# Altium schematic sheet STM32.SchDoc
size A4
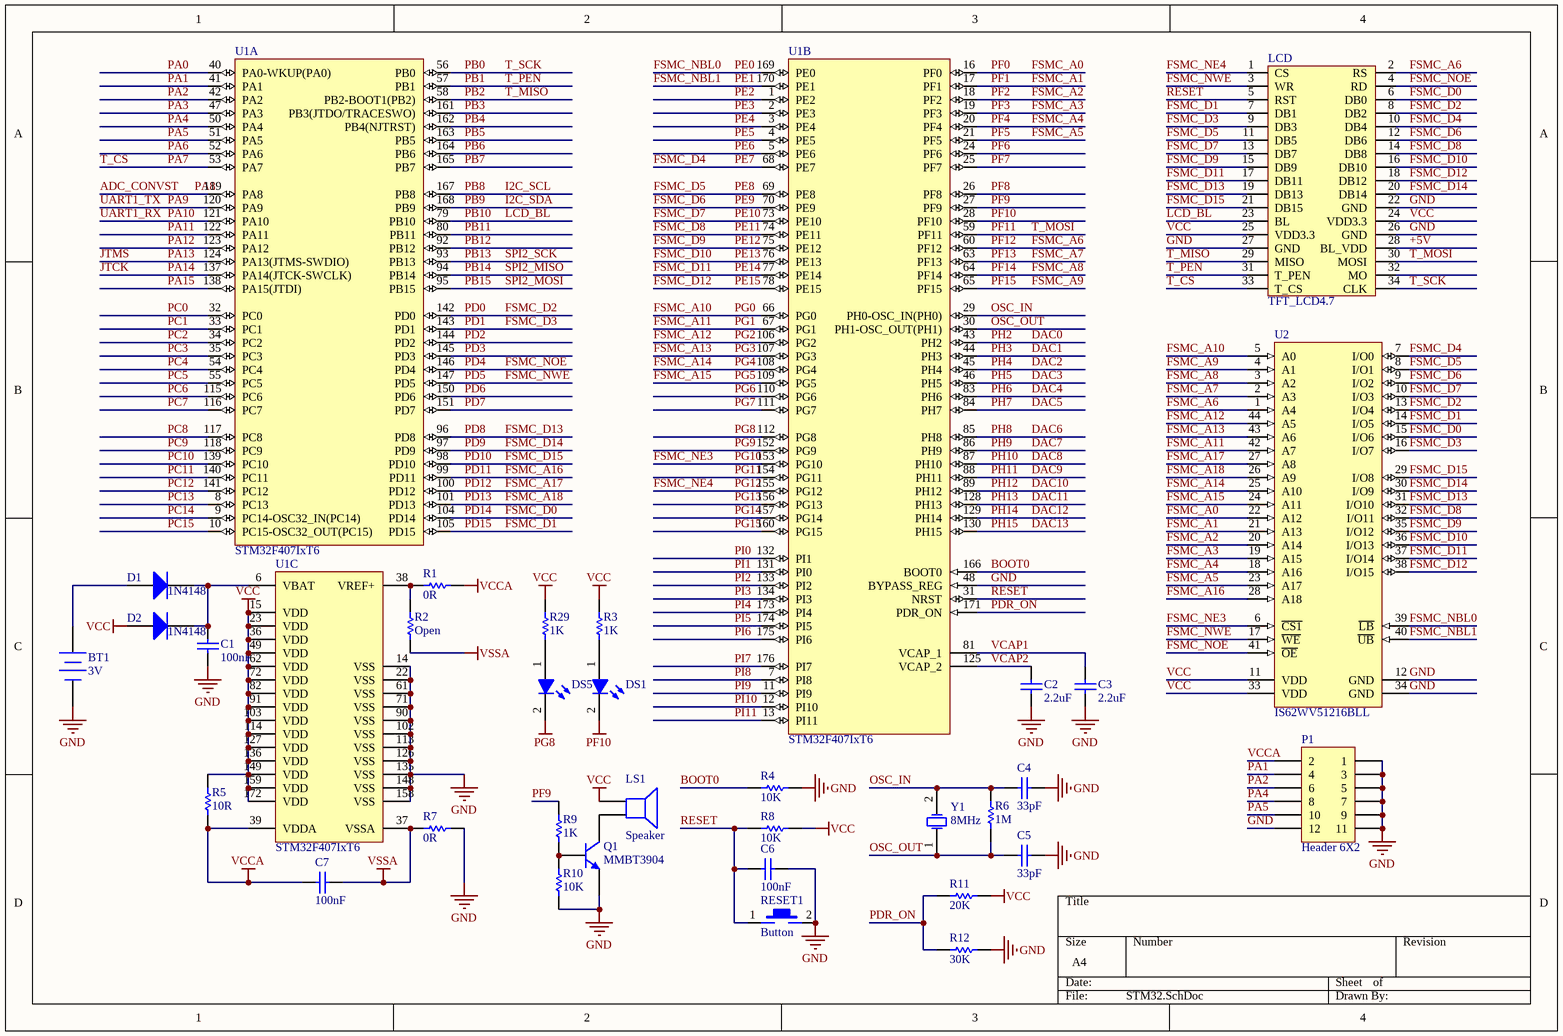
[diagram p0: STM32.SchDoc]

## Parts
BT1  3V  [BAT-2]
C1  100nF  [CAPC0603(1608)55_M]
C2  2.2uF  [CAPC0603(1608)55_M]
C3  2.2uF  [CAPC0603(1608)55_M]
C4  33pF  [CAPC0603(1608)55_M]
C5  33pF  [CAPC0603(1608)55_M]
C6  100nF  [CAPC0603(1608)55_M]
C7  100nF  [CAPC0603(1608)55_M]
D1  1N4148  [LL34]
D2  1N4148  [LL34]
DS1  LED-BLUE  [0603LED_BLUE_V]  (value not drawn)
DS5  LED-BLUE  [0603LED_BLUE_V]  (value not drawn)
LCD  TFT_LCD4.7  [DB2*17-3.5]
LS1  Speaker  [Buzzer]
P1  Header 6X2  [HDR2X6]
Q1  MMBT3904  [SOT23_M]
R1  0R  [RESC0603(1608)_M]
R2  Open  [RESC0603(1608)_M]
R3  1K  [RESC0603(1608)_M]
R4  10K  [RESC0603(1608)_M]
R5  10R  [RESC0603(1608)_M]
R6  1M  [RESC0603(1608)_M]
R7  0R  [RESC0603(1608)_M]
R8  10K  [RESC0603(1608)_M]
R9  1K  [RESC0603(1608)_M]
R10  10K  [RESC0603(1608)_M]
R11  20K  [RESC0603(1608)_M]
R12  30K  [RESC0603(1608)_M]
R29  1K  [RESC0603(1608)_M]
RESET1  Button  [Button665]
U1  STM32F407IxT6  [LQFP176]  (parts A,B,C of 3)
U2  IS62WV51216BLL  [TSOP-2-44]
Y1  8MHz  [HC-49S]

## Nets
GND: BT1.2(-) C1.2 C2.1 C3.1 C4.2 C5.2 C6.2 LCD.22(GND) LCD.26(GND) LCD.27(GND) P1.1 P1.3 P1.5 P1.7 P1.9 P1.11 P1.12 Q1.2(E) R4.1 R7.1 R10.1 R12.1 RESET1.2 U1.14(VSS) U1.22(VSS) U1.48(BYPASS_REG) U1.61(VSS) U1.71(VSS) U1.90(VSS) U1.102(VSS) U1.113(VSS) U1.126(VSS) U1.135(VSS) U1.148(VSS) U1.158(VSS) U2.12(GND) U2.34(GND)
PF10: DS1.2(K) U1.28(PF10)
PG8: DS5.2(K) U1.112(PG8)
VCC: D2.2(A) LCD.24(VDD3.3) LCD.25(VDD3.3) LS1.1 R3.2 R5.2 R8.1 R11.1 R29.2 U1.15(VDD) U1.23(VDD) U1.36(VDD) U1.49(VDD) U1.62(VDD) U1.72(VDD) U1.82(VDD) U1.91(VDD) U1.103(VDD) U1.114(VDD) U1.127(VDD) U1.136(VDD) U1.149(VDD) U1.159(VDD) U1.172(VDD) U2.11(VDD) U2.33(VDD)
VCCA: C7.1 P1.2 R1.1 R5.1 U1.39(VDDA)
VSSA: C7.2 R2.1 R7.2 U1.37(VSSA)
+5V: LCD.28(BL_VDD)
ADC_CONVST: U1.119(PA8)  [also labelled PA8]
BOOT0: R4.2 U1.166(BOOT0)
DAC0: U1.43(PH2)  [also labelled PH2]
DAC1: U1.44(PH3)  [also labelled PH3]
DAC2: U1.45(PH4)  [also labelled PH4]
DAC3: U1.46(PH5)  [also labelled PH5]
DAC4: U1.83(PH6)  [also labelled PH6]
DAC5: U1.84(PH7)  [also labelled PH7]
DAC6: U1.85(PH8)  [also labelled PH8]
DAC7: U1.86(PH9)  [also labelled PH9]
DAC8: U1.87(PH10)  [also labelled PH10]
DAC9: U1.88(PH11)  [also labelled PH11]
DAC10: U1.89(PH12)  [also labelled PH12]
DAC11: U1.128(PH13)  [also labelled PH13]
DAC12: U1.129(PH14)  [also labelled PH14]
DAC13: U1.130(PH15)  [also labelled PH15]
FSMC_A0: U1.16(PF0) U2.22(A12)  [also labelled PF0]
FSMC_A1: U1.17(PF1) U2.21(A13)  [also labelled PF1]
FSMC_A2: U1.18(PF2) U2.20(A14)  [also labelled PF2]
FSMC_A3: U1.19(PF3) U2.19(A15)  [also labelled PF3]
FSMC_A4: U1.20(PF4) U2.18(A16)  [also labelled PF4]
FSMC_A5: U1.21(PF5) U2.23(A17)  [also labelled PF5]
FSMC_A6: LCD.2(RS) U1.60(PF12) U2.1(A4)  [also labelled PF12]
FSMC_A7: U1.63(PF13) U2.2(A3)  [also labelled PF13]
FSMC_A8: U1.64(PF14) U2.3(A2)  [also labelled PF14]
FSMC_A9: U1.65(PF15) U2.4(A1)  [also labelled PF15]
FSMC_A10: U1.66(PG0) U2.5(A0)  [also labelled PG0]
FSMC_A11: U1.67(PG1) U2.42(A7)  [also labelled PG1]
FSMC_A12: U1.106(PG2) U2.44(A5)  [also labelled PG2]
FSMC_A13: U1.107(PG3) U2.43(A6)  [also labelled PG3]
FSMC_A14: U1.108(PG4) U2.25(A10)  [also labelled PG4]
FSMC_A15: U1.109(PG5) U2.24(A11)  [also labelled PG5]
FSMC_A16: U1.99(PD11) U2.28(A18)  [also labelled PD11]
FSMC_A17: U1.100(PD12) U2.27(A8)  [also labelled PD12]
FSMC_A18: U1.101(PD13) U2.26(A9)  [also labelled PD13]
FSMC_D0: LCD.6(DB0) U1.104(PD14) U2.15(I/O6)  [also labelled PD14]
FSMC_D1: LCD.7(DB1) U1.105(PD15) U2.14(I/O5)  [also labelled PD15]
FSMC_D2: LCD.8(DB2) U1.142(PD0) U2.13(I/O4)  [also labelled PD0]
FSMC_D3: LCD.9(DB3) U1.143(PD1) U2.16(I/O7)  [also labelled PD1]
FSMC_D4: LCD.10(DB4) U1.68(PE7) U2.7(I/O0)  [also labelled PE7]
FSMC_D5: LCD.11(DB5) U1.69(PE8) U2.8(I/O1)  [also labelled PE8]
FSMC_D6: LCD.12(DB6) U1.70(PE9) U2.9(I/O2)  [also labelled PE9]
FSMC_D7: LCD.13(DB7) U1.73(PE10) U2.10(I/O3)  [also labelled PE10]
FSMC_D8: LCD.14(DB8) U1.74(PE11) U2.32(I/O11)  [also labelled PE11]
FSMC_D9: LCD.15(DB9) U1.75(PE12) U2.35(I/O12)  [also labelled PE12]
FSMC_D10: LCD.16(DB10) U1.76(PE13) U2.36(I/O13)  [also labelled PE13]
FSMC_D11: LCD.17(DB11) U1.77(PE14) U2.37(I/O14)  [also labelled PE14]
FSMC_D12: LCD.18(DB12) U1.78(PE15) U2.38(I/O15)  [also labelled PE15]
FSMC_D13: LCD.19(DB13) U1.96(PD8) U2.31(I/O10)  [also labelled PD8]
FSMC_D14: LCD.20(DB14) U1.97(PD9) U2.30(I/O9)  [also labelled PD9]
FSMC_D15: LCD.21(DB15) U1.98(PD10) U2.29(I/O8)  [also labelled PD10]
FSMC_NBL0: U1.169(PE0) U2.39(~{LB})  [also labelled PE0]
FSMC_NBL1: U1.170(PE1) U2.40(~{UB})  [also labelled PE1]
FSMC_NE3: U1.153(PG10) U2.6(~{CS1})  [also labelled PG10]
FSMC_NE4: LCD.1(CS) U1.155(PG12)  [also labelled PG12]
FSMC_NOE: LCD.4(RD) U1.146(PD4) U2.41(~{OE})  [also labelled PD4]
FSMC_NWE: LCD.3(WR) U1.147(PD5) U2.17(~{WE})  [also labelled PD5]
I2C_SCL: U1.167(PB8)  [also labelled PB8]
I2C_SDA: U1.168(PB9)  [also labelled PB9]
JTCK: U1.137(PA14(JTCK-SWCLK))  [also labelled PA14]
JTMS: U1.124(PA13(JTMS-SWDIO))  [also labelled PA13]
LCD_BL: LCD.23(BL) U1.79(PB10)  [also labelled PB10]
OSC_IN: C4.1 R6.2 U1.29(PH0-OSC_IN(PH0)) Y1.2(OSC2)
OSC_OUT: C5.1 R6.1 U1.30(PH1-OSC_OUT(PH1)) Y1.1(OSC1)
PA0: U1.40(PA0-WKUP(PA0))
PA1: P1.4 U1.41(PA1)
PA2: P1.6 U1.42(PA2)
PA3: U1.47(PA3)
PA4: P1.8 U1.50(PA4)
PA5: P1.10 U1.51(PA5)
PA6: U1.52(PA6)
PA7: LCD.33(T_CS) U1.53(PA7)  [also labelled T_CS]
PA9: U1.120(PA9)  [also labelled UART1_TX]
PA10: U1.121(PA10)  [also labelled UART1_RX]
PA11: U1.122(PA11)
PA12: U1.123(PA12)
PA15: U1.138(PA15(JTDI))
PB0: LCD.34(CLK) U1.56(PB0)  [also labelled T_SCK]
PB1: LCD.31(T_PEN) U1.57(PB1)  [also labelled T_PEN]
PB2: LCD.29(MISO) U1.58(PB2-BOOT1(PB2))  [also labelled T_MISO]
PB3: U1.161(PB3(JTDO/TRACESWO))
PB4: U1.162(PB4(NJTRST))
PB5: U1.163(PB5)
PB6: U1.164(PB6)
PB7: U1.165(PB7)
PB11: U1.80(PB11)
PB12: U1.92(PB12)
PB13: U1.93(PB13)  [also labelled SPI2_SCK]
PB14: U1.94(PB14)  [also labelled SPI2_MISO]
PB15: U1.95(PB15)  [also labelled SPI2_MOSI]
PC0: U1.32(PC0)
PC1: U1.33(PC1)
PC2: U1.34(PC2)
PC3: U1.35(PC3)
PC4: U1.54(PC4)
PC5: U1.55(PC5)
PC6: U1.115(PC6)
PC7: U1.116(PC7)
PC8: U1.117(PC8)
PC9: U1.118(PC9)
PC10: U1.139(PC10)
PC11: U1.140(PC11)
PC12: U1.141(PC12)
PC13: U1.8(PC13)
PC14: U1.9(PC14-OSC32_IN(PC14))
PC15: U1.10(PC15-OSC32_OUT(PC15))
PD2: U1.144(PD2)
PD3: U1.145(PD3)
PD6: U1.150(PD6)
PD7: U1.151(PD7)
PDR_ON: R11.2 R12.2 U1.171(PDR_ON)
PE2: U1.1(PE2)
PE3: U1.2(PE3)
PE4: U1.3(PE4)
PE5: U1.4(PE5)
PE6: U1.5(PE6)
PF6: U1.24(PF6)
PF7: U1.25(PF7)
PF8: U1.26(PF8)
PF9: R9.2 U1.27(PF9)
PF11: LCD.30(MOSI) U1.59(PF11)  [also labelled T_MOSI]
PG6: U1.110(PG6)
PG7: U1.111(PG7)
PG9: U1.152(PG9)
PG11: U1.154(PG11)
PG13: U1.156(PG13)
PG14: U1.157(PG14)
PG15: U1.160(PG15)
PI0: U1.132(PI1)
PI1: U1.131(PI0)
PI2: U1.133(PI2)
PI3: U1.134(PI3)
PI4: U1.173(PI4)
PI5: U1.174(PI5)
PI6: U1.175(PI6)
PI7: U1.176(PI7)
PI8: U1.7(PI8)
PI9: U1.11(PI9)
PI10: U1.12(PI10)
PI11: U1.13(PI11)
RESET: C6.1 LCD.5(RST) R8.2 RESET1.1 U1.31(NRST)
VCAP1: C3.2 U1.81(VCAP_1)
VCAP2: C2.2 U1.125(VCAP_2)
NetBT1_1: BT1.1(+) D1.2(A)
NetC1_1: C1.1 D1.1(K) D2.1(K) U1.6(VBAT)
NetDS1_1: DS1.1(A) R3.1
NetDS5_1: DS5.1(A) R29.1
NetLS1_2: LS1.2 Q1.3(C)
NetQ1_1: Q1.1(B) R9.1 R10.2
NetR1_2: R1.2 R2.2 U1.38(VREF+)

Not connected (* = marked no-connect by the designer): LCD 32(MO)

## Library data of the parts
BT1 = Battery: Multicell Battery; Published: 24-Mar-1999; LatestRevisionDate: 17-Jul-2002; LatestRevisionNote: Re-released for DXP Platform.; PackageReference: BAT-2; Publisher: Altium Limited; PackageDescription: Battery; 2 Leads
C1-C7 = CAP
D1 D2 = Diode: pin to pad: 1>2 2>1
LS1 = Speaker: Loudspeaker; Published: 24-Mar-1999; LatestRevisionDate: 17-Jul-2002; LatestRevisionNote: Re-released for DXP Platform.; PackageReference: PIN2; Publisher: Altium Limited
P1 = Header 6X2: Header, 6-Pin, Dual row; LatestRevisionDate: 17-Jul-2002; LatestRevisionNote: Re-released for DXP Platform.; Publisher: Altium Limited
Q1 = MMBT3904: NPN General Purpose Amplifier; Published: 8-Jun-2000; LatestRevisionDate: 15-Jan-2003; LatestRevisionNote: PCB Footprint 'BCY-W3/D4.7' replaced; DatasheetVersion: 1997; PackageVersion: Sep-1998; PackageReference: TO-92A; Publisher: Altium Limited; PackageDescription: TO, Flat Index; 3 In-Line, Axial Leads; Body Dia. 4.5mm; Leads 0.51 x 0.48 mm (max); ComponentLink1Description: Manufacturer Link; ComponentLink1URL: http://www.fairchildsemi.com/; ComponentLink2Description: Datasheet; ComponentLink2URL: http://www.fairchildsemi.com/ds/2N%2F2N3904.pdf
R1-R12 R29 = RES
Y1 = XTAL: Crystal Oscillator; Published: 8-Jun-2000; LatestRevisionDate: 17-Jul-2002; LatestRevisionNote: Re-released for DXP Platform.; PackageReference: R38; Publisher: Altium Limited; PackageDescription: Crystal, Thru-Hole; 2 Leads; Body 3.1 x 8.2 mm (Dia.xH)